# EAGLE schematic Front (EAGLE 7.4.0)
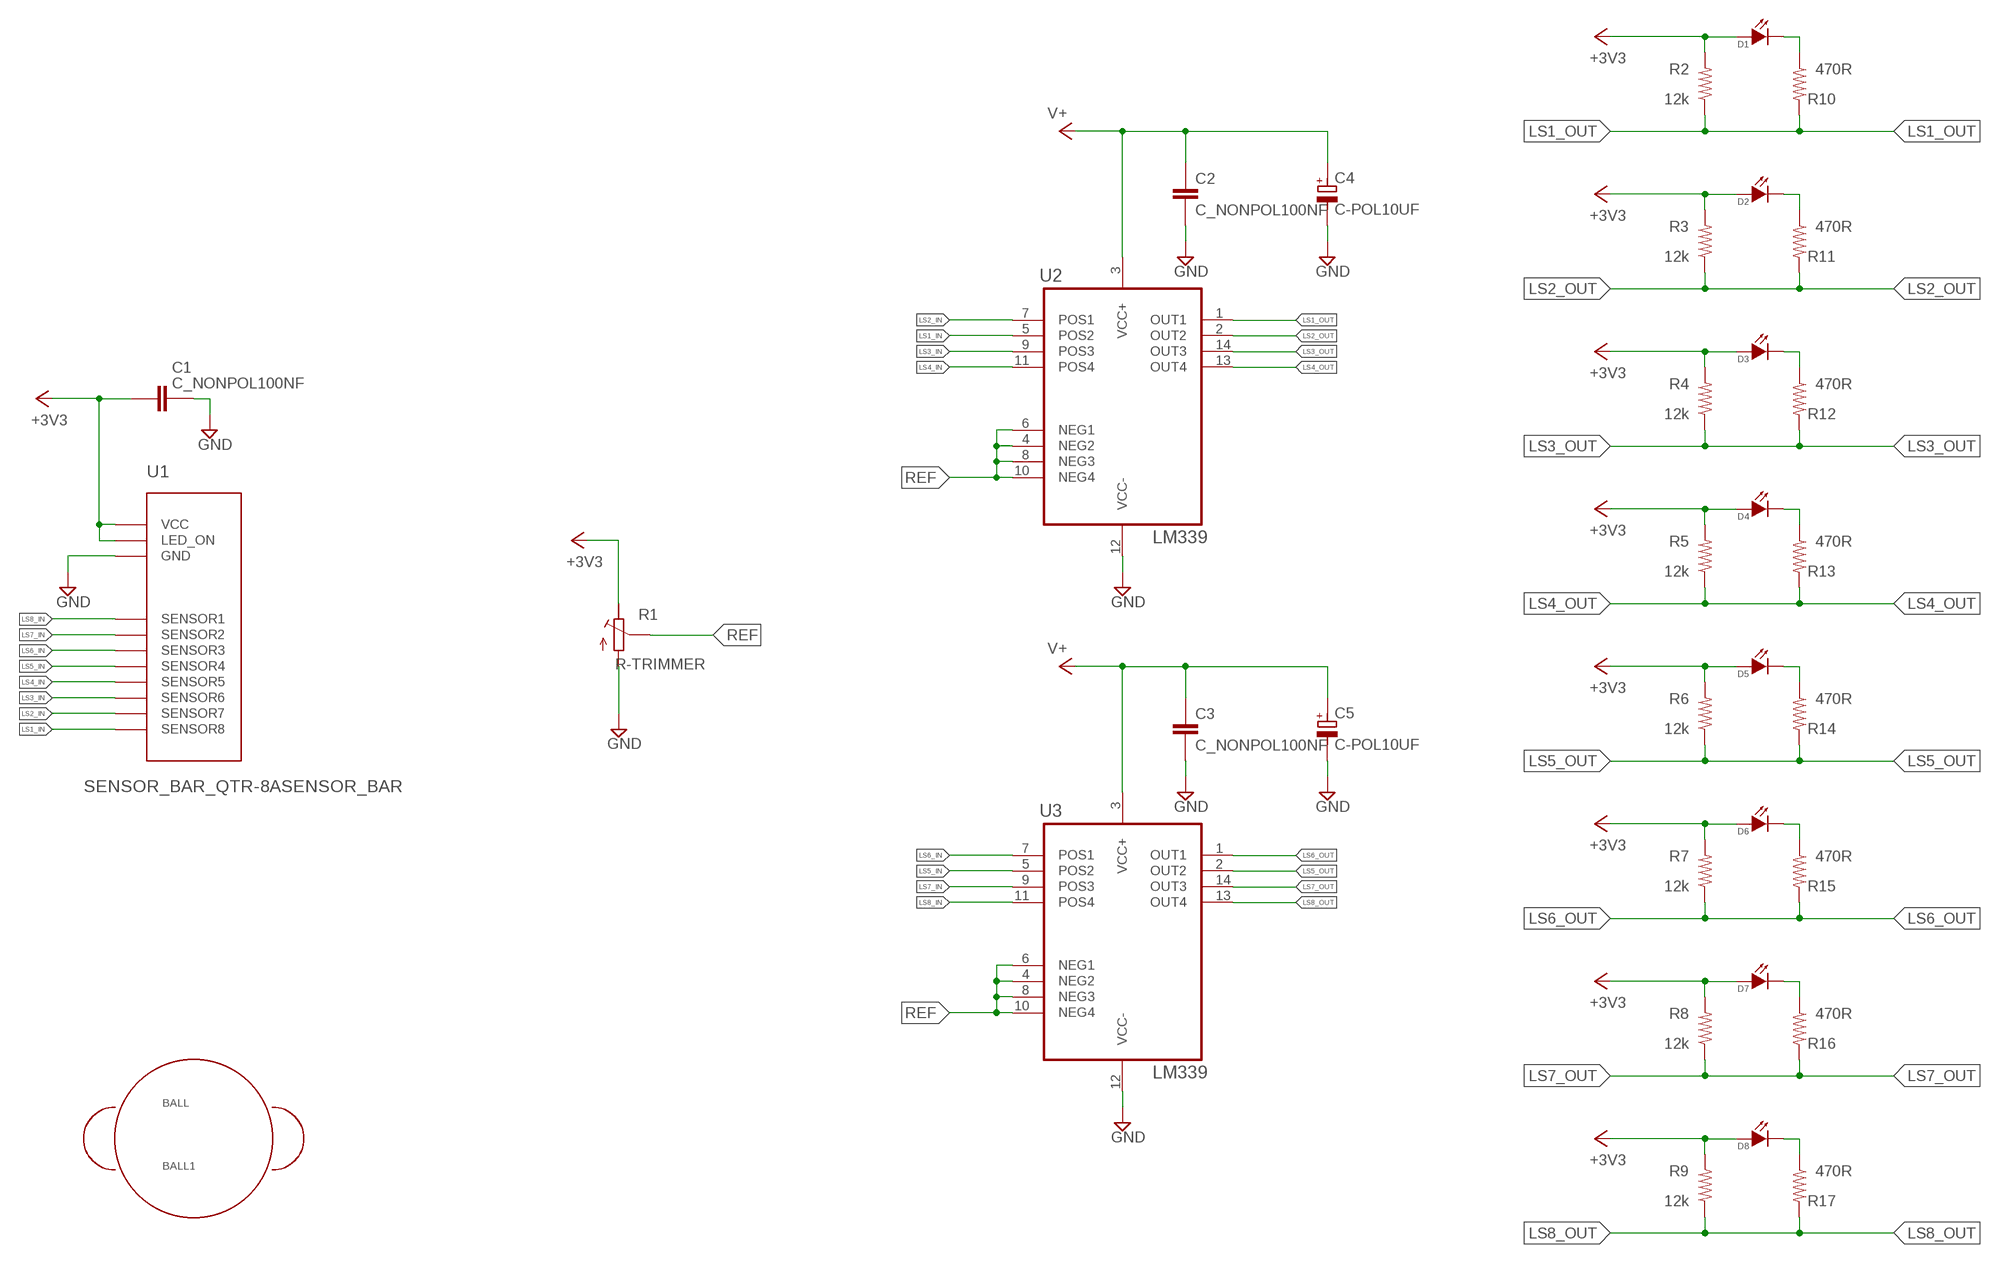
[diagram p0: schematic, sheet 1, part 1 of 2]
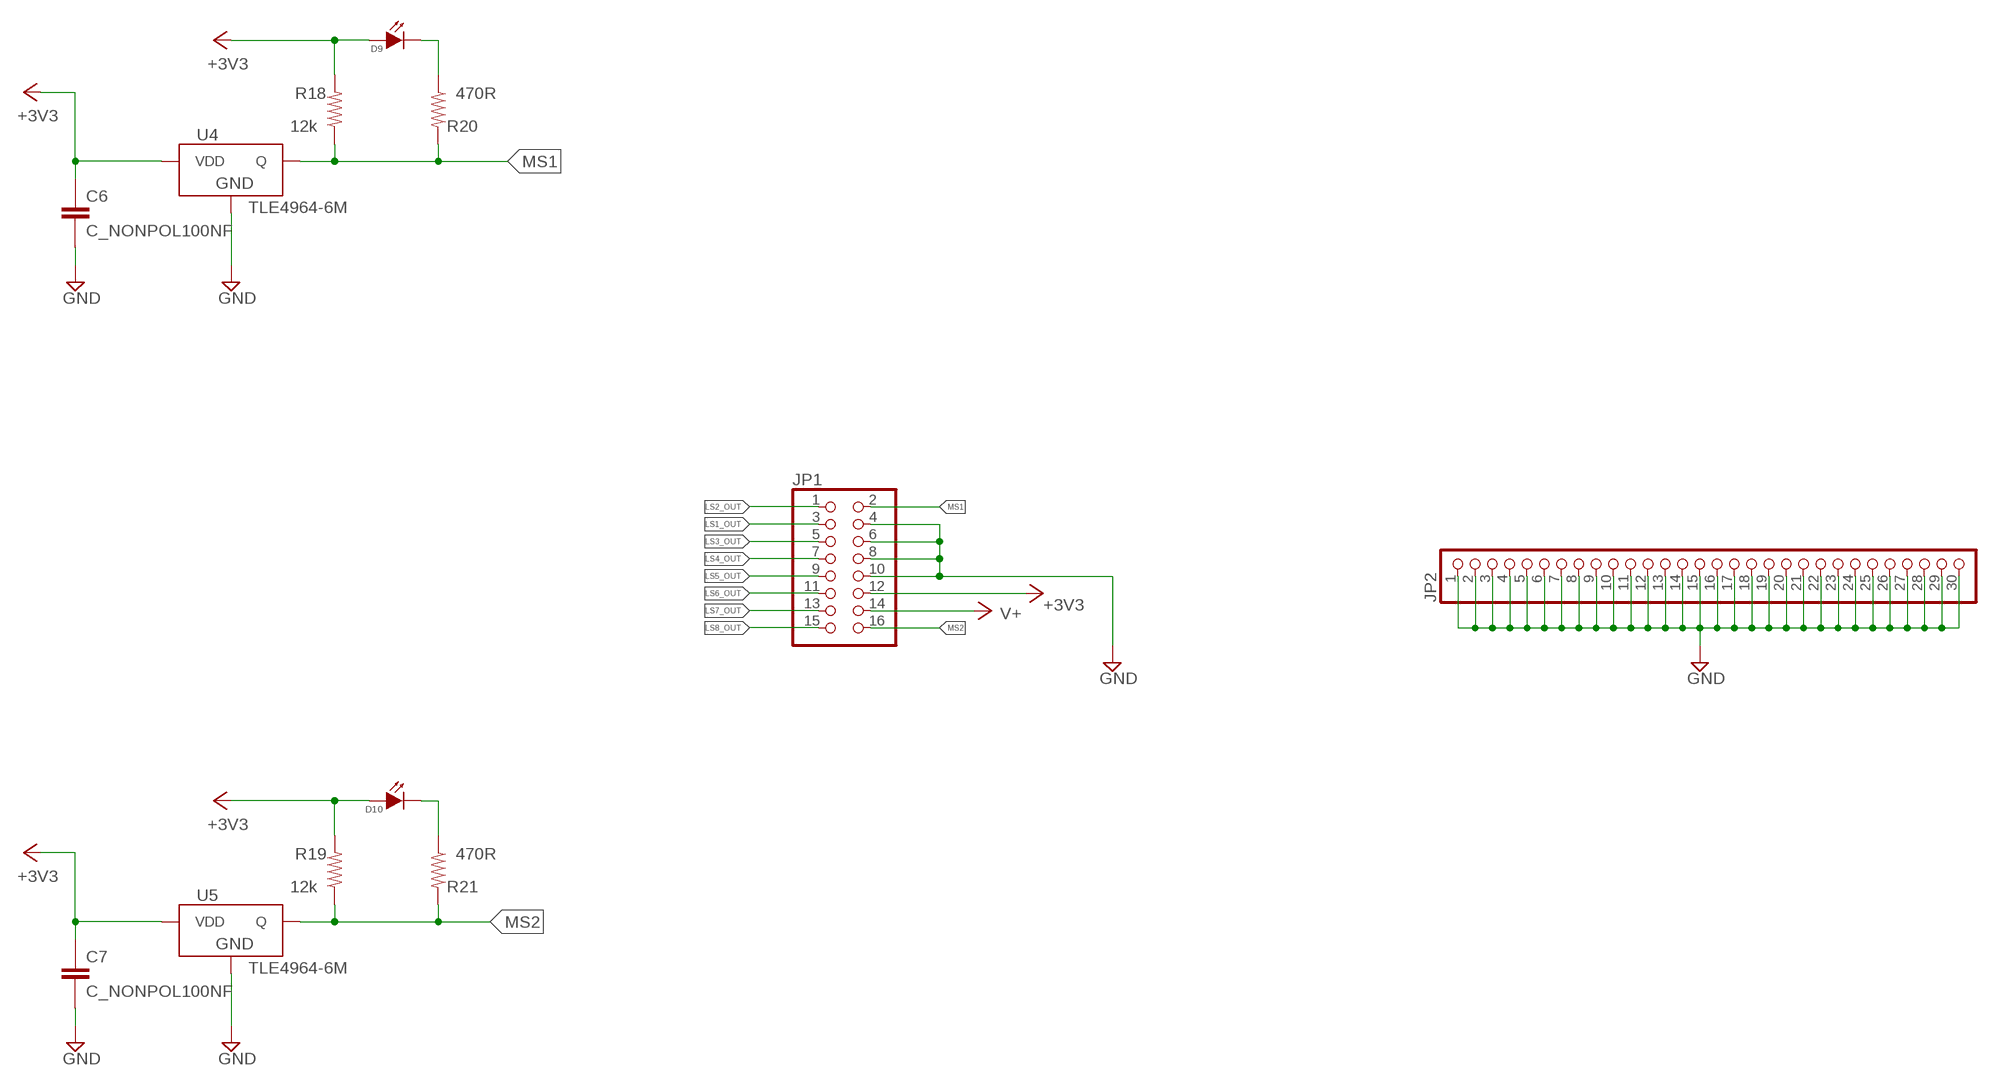
[diagram p1: schematic, sheet 1, part 2 of 2]

## Parts
BALL1  BALL  [BALL]
C1  C_NONPOL100NF  [C1206]
C2  C_NONPOL100NF  [C1206]
C3  C_NONPOL100NF  [C1206]
C4  C-POL10UF  [PANASONIC_B]
C5  C-POL10UF  [PANASONIC_B]
C6  C_NONPOL100NF  [C1206]
C7  C_NONPOL100NF  [C1206]
D1  LED  [CHIPLED_1206]
D2  LED  [CHIPLED_1206]
D3  LED  [CHIPLED_1206]
D4  LED  [CHIPLED_1206]
D5  LED  [CHIPLED_1206]
D6  LED  [CHIPLED_1206]
D7  LED  [CHIPLED_1206]
D8  LED  [CHIPLED_1206]
D9  LED  [CHIPLED_1206]
D10  LED  [CHIPLED_1206]
JP1  PINHD-2X8  [2X08]
JP2  PINHD-1X30  [1X30]
R1  R-TRIMMER  [TRIMMER]
R2  12k  R1206  [R1206]
R3  12k  R1206  [R1206]
R4  12k  R1206  [R1206]
R5  12k  R1206  [R1206]
R6  12k  R1206  [R1206]
R7  12k  R1206  [R1206]
R8  12k  R1206  [R1206]
R9  12k  R1206  [R1206]
R10  470R  R1206  [R1206]
R11  470R  R1206  [R1206]
R12  470R  R1206  [R1206]
R13  470R  R1206  [R1206]
R14  470R  R1206  [R1206]
R15  470R  R1206  [R1206]
R16  470R  R1206  [R1206]
R17  470R  R1206  [R1206]
R18  12k  R1206  [R1206]
R19  12k  R1206  [R1206]
R20  470R  R1206  [R1206]
R21  470R  R1206  [R1206]
U1  SENSOR_BAR_QTR-8ASENSOR_BAR  [QTR-8A]
U2  LM339  [SO14]
U3  LM339  [SO14]
U4  TLE4964-6M  [SOT23-3]
U5  TLE4964-6M  [SOT23-3]

## Nets
+3V3: C1.2 C6.1 C7.1 D1.A D2.A D3.A D4.A D5.A D6.A D7.A D8.A D9.A D10.A JP1.12 R1.2(E) R2.2 R3.2 R4.2 R5.2 R6.2 R7.2 R8.2 R9.2 R18.2 R19.2 U1.P$2(LED_ON) U1.P$4(VCC) U4.1(VDD) U5.1(VDD)
GND: C1.1 C2.2 C3.2 C4.- C5.- C6.2 C7.2 JP1.4 JP1.6 JP1.8 JP1.10 JP2.1 JP2.2 JP2.3 JP2.4 JP2.5 JP2.6 JP2.7 JP2.8 JP2.9 JP2.10 JP2.11 JP2.12 JP2.13 JP2.14 JP2.15 JP2.16 JP2.17 JP2.18 JP2.19 JP2.20 JP2.21 JP2.22 JP2.23 JP2.24 JP2.25 JP2.26 JP2.27 JP2.28 JP2.29 JP2.30 R1.1(A) U1.P$6(GND) U1.P$8(GND) U1.P$10(GND) U1.P$12(GND) U1.P$14(GND) U1.P$16(GND) U2.12(VCC-) U3.12(VCC-) U4.3(GND) U5.3(GND)
LS1_IN: U1.P$15(SENSOR8) U2.5(POS2)
LS1_OUT: JP1.3 R2.1 R10.2 U2.1(OUT1)
LS2_IN: U1.P$13(SENSOR7) U2.7(POS1)
LS2_OUT: JP1.1 R3.1 R11.2 U2.2(OUT2)
LS3_IN: U1.P$11(SENSOR6) U2.9(POS3)
LS3_OUT: JP1.5 R4.1 R12.2 U2.14(OUT3)
LS4_IN: U1.P$9(SENSOR5) U2.11(POS4)
LS4_OUT: JP1.7 R5.1 R13.2 U2.13(OUT4)
LS5_IN: U1.P$7(SENSOR4) U3.5(POS2)
LS5_OUT: JP1.9 R6.1 R14.2 U3.2(OUT2)
LS6_IN: U1.P$5(SENSOR3) U3.7(POS1)
LS6_OUT: JP1.11 R7.1 R15.2 U3.1(OUT1)
LS7_IN: U1.P$3(SENSOR2) U3.9(POS3)
LS7_OUT: JP1.13 R8.1 R16.2 U3.14(OUT3)
LS8_IN: U1.P$1(SENSOR1) U3.11(POS4)
LS8_OUT: JP1.15 R9.1 R17.2 U3.13(OUT4)
MS1: JP1.2 R18.1 R20.2 U4.2(Q)
MS2: JP1.16 R19.1 R21.2 U5.2(Q)
N$1: D1.C(K) R10.1
N$2: D2.C(K) R11.1
N$3: D3.C(K) R12.1
N$4: D4.C(K) R13.1
N$5: D5.C(K) R14.1
N$6: D6.C(K) R15.1
N$7: D7.C(K) R16.1
N$8: D8.C(K) R17.1
N$9: D10.C(K) R21.1
N$10: D9.C(K) R20.1
REF: R1.3(S) U2.4(NEG2) U2.6(NEG1) U2.8(NEG3) U2.10(NEG4) U3.4(NEG2) U3.6(NEG1) U3.8(NEG3) U3.10(NEG4)
V+: C2.1 C3.1 C4.+ C5.+ JP1.14 U2.3(VCC+) U3.3(VCC+)

## Library data of the parts
BALL1 = Line_Follower_LIBV3.1:BALL
C1 C6 C7 = Line_Follower_LIBV3:C_NONPOL
C2 C3 = Line_Follower_LIBV3.1:C_NONPOL
C4 C5 = Line_Follower_LIBV3.1:C-POL
D1-D10 = Line_Follower_LIBV3:LED
JP1 = pinhead:PINHD-2X8: PIN HEADER
JP2 = pinhead:PINHD-1X30: PIN HEADER
R1 = Line_Follower_LIBV3:R-TRIMMER
R2-R21 = Line_Follower_LIBV3:R
U1 = Line_Follower_LIBV3:SENSOR_BAR_QTR-8A
U2 U3 = Line_Follower_LIBV3:LM339
U4 U5 = Line_Follower_LIBV3:TLE4964-6M